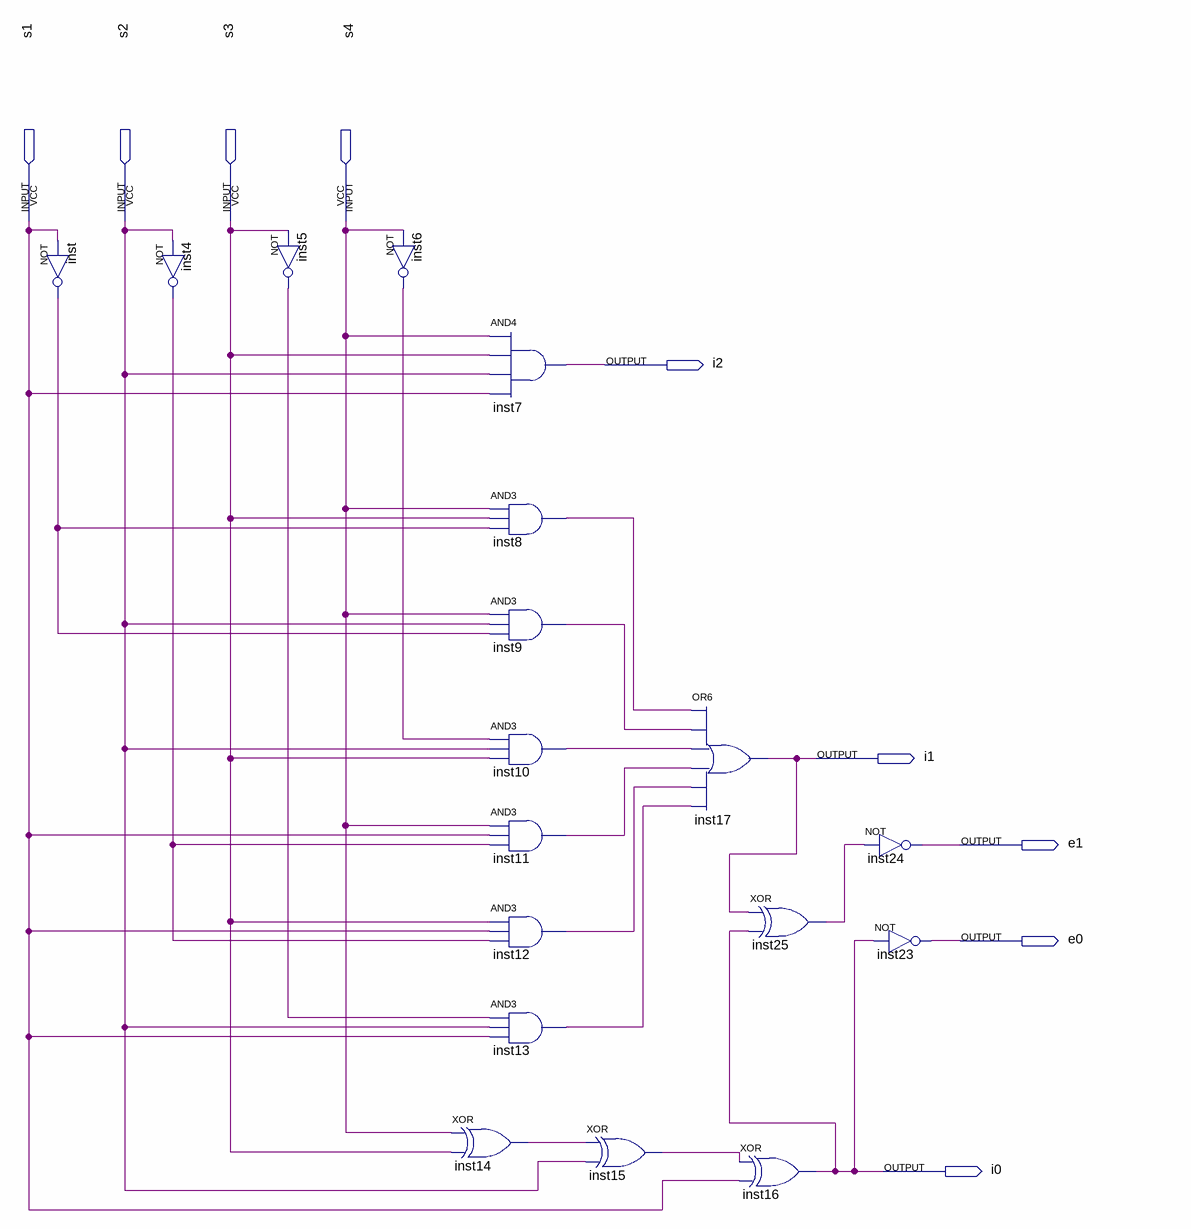
[diagram p0: schematic sheet]
// Quartus schematic led.bdf as structural Verilog: 18 symbols, 9 pins
module led (
  input  s1,
  input  s2,
  input  s3,
  input  s4,
  output i2,
  output i1,
  output e1,
  output e0,
  output i0
);

  wire inst4_out, inst5_out, inst6_out, inst8_out, inst9_out, inst10_out, inst11_out, inst12_out, inst13_out,
       inst14_out, inst15_out, inst25_out, inst_out;

  not inst (inst_out, s1);
  not inst4 (inst4_out, s2);
  not inst5 (inst5_out, s3);
  not inst6 (inst6_out, s4);
  xor inst14 (inst14_out, s4, s3);
  and inst7 (i2, s4, s3, s2, s1);
  and inst8 (inst8_out, s4, s3, inst_out);
  and inst9 (inst9_out, s4, s2, inst_out);
  and inst10 (inst10_out, inst6_out, s2, s3);
  and inst11 (inst11_out, s4, s1, inst4_out);
  and inst12 (inst12_out, s3, s1, inst4_out);
  and inst13 (inst13_out, inst5_out, s2, s1);
  xor inst15 (inst15_out, inst14_out, s2);
  or inst17 (i1, inst8_out, inst9_out, inst10_out, inst11_out, inst12_out, inst13_out);
  xor inst25 (inst25_out, i1, i0);
  xor inst16 (i0, inst15_out, s1);
  not inst24 (e1, inst25_out);
  not inst23 (e0, i0);
endmodule
